# Altium project SGC tester board.PrjPcb
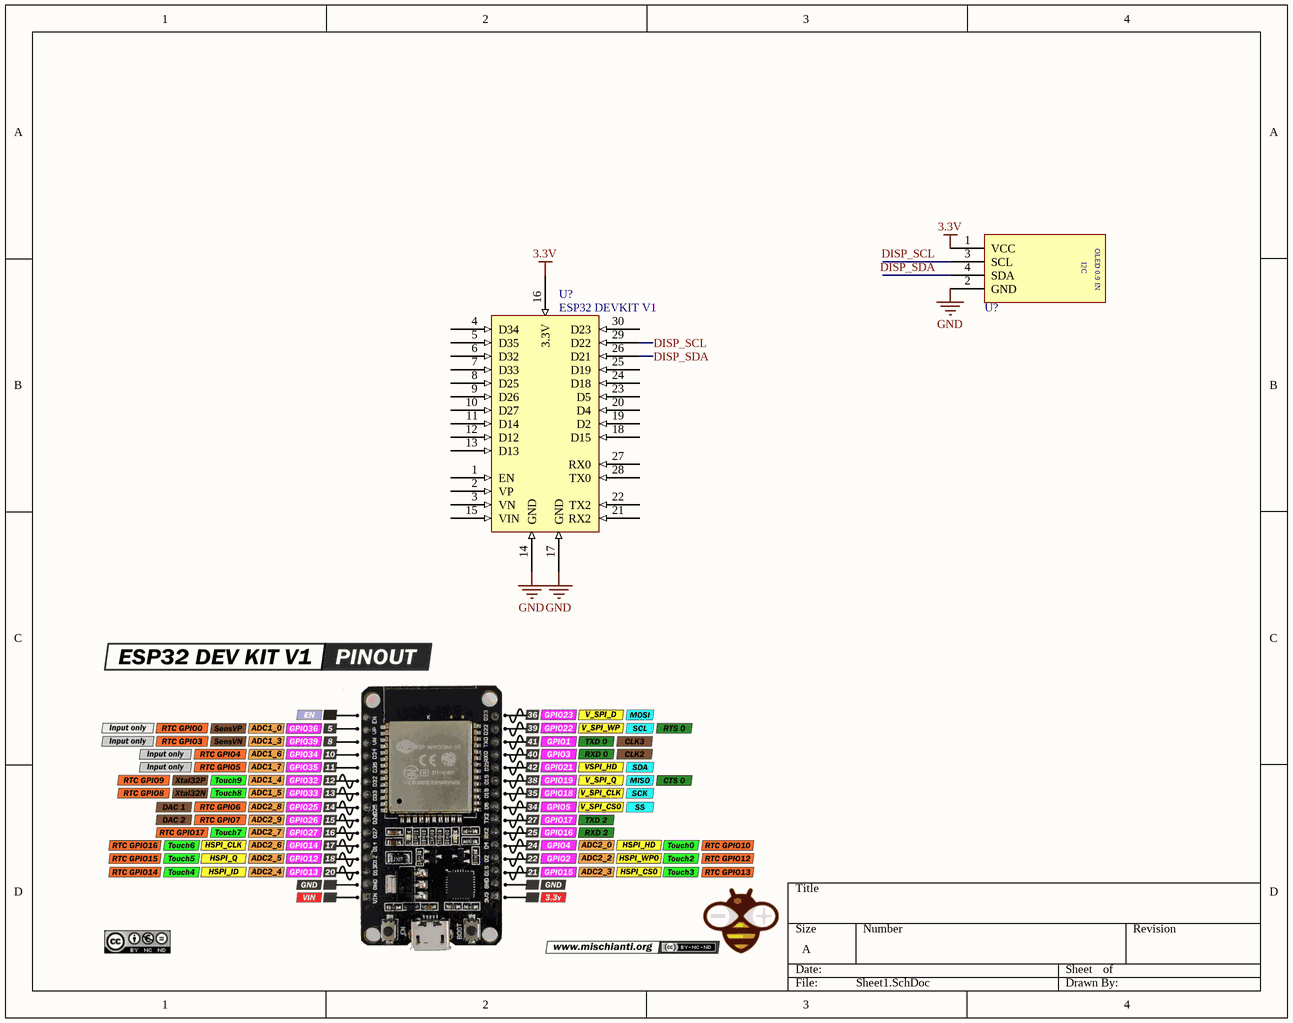
[diagram p0: Sheet1.SchDoc]
1 sheet, 2 parts. Net scope: global (net labels, ports and power ports of the same name join across sheets).

## Sheet Sheet1.SchDoc
size A; SheetNumber: 1; SheetTotal: 1

### Parts
(Parts that share a designator on the sheet are numbered #1, #2 ... from top to bottom, then left to right.)
U?#1  OLED SSD1306 I2C  [OLED_SSD1306_64_I2C]  (value not drawn)
U?#2  ESP32 DEVKIT V1  [ESP32 DEVKIT V1]

### Nets
3.3V: U?#1.1(VCC) U?#2.16(3.3V)
GND: U?#1.2(GND) U?#2.14(GND) U?#2.17(GND)
DISP_SCL: U?#1.3(SCL) U?#2.29(D22)
DISP_SDA: U?#1.4(SDA) U?#2.26(D21)

Not connected (* = marked no-connect by the designer): U?#2 1(EN) 2(VP) 3(VN) 4(D34) 5(D35) 6(D32) 7(D33) 8(D25) 9(D26) 10(D27) 11(D14) 12(D12) 13(D13) 15(VIN) 18(D15) 19(D2) 20(D4) 21(RX2) 22(TX2) 23(D5) 24(D18) 25(D19) 27(RX0) 28(TX0) 30(D23)

### Notes on the sheet
- (in symbol OLED SSD1306 I2C) OLED 0.9 IN; I2C

### Library data of the parts
U?#1 = OLED SSD1306 I2C: OLED, SSD1306, 0.96", 128X64, BREAKOUT I2C; DatasheetVersion: 2022; ComponentLink2Description: WebSite: pcblearn; ComponentLink2URL: www.pcblearn.com
U?#2 = DOIT ESP32 DEVKIT V1